# Altium schematic sheet AUDIO2.SchDoc: Audio Codec and Microphone MEMS
size A4; Date: 9/24/2014; Author: P.A.; CompanyName: STMicroelectronics; Organization: Microcontrollers Division; Address1: 12, Rue Jules HOROWITZ; Address2: 38019 Grenoble; Address3: FRANCE; DocumentNumber: 7; Revision: B-07; SheetNumber: 7; SheetTotal: 13; Project: STM32F469I-DISCO
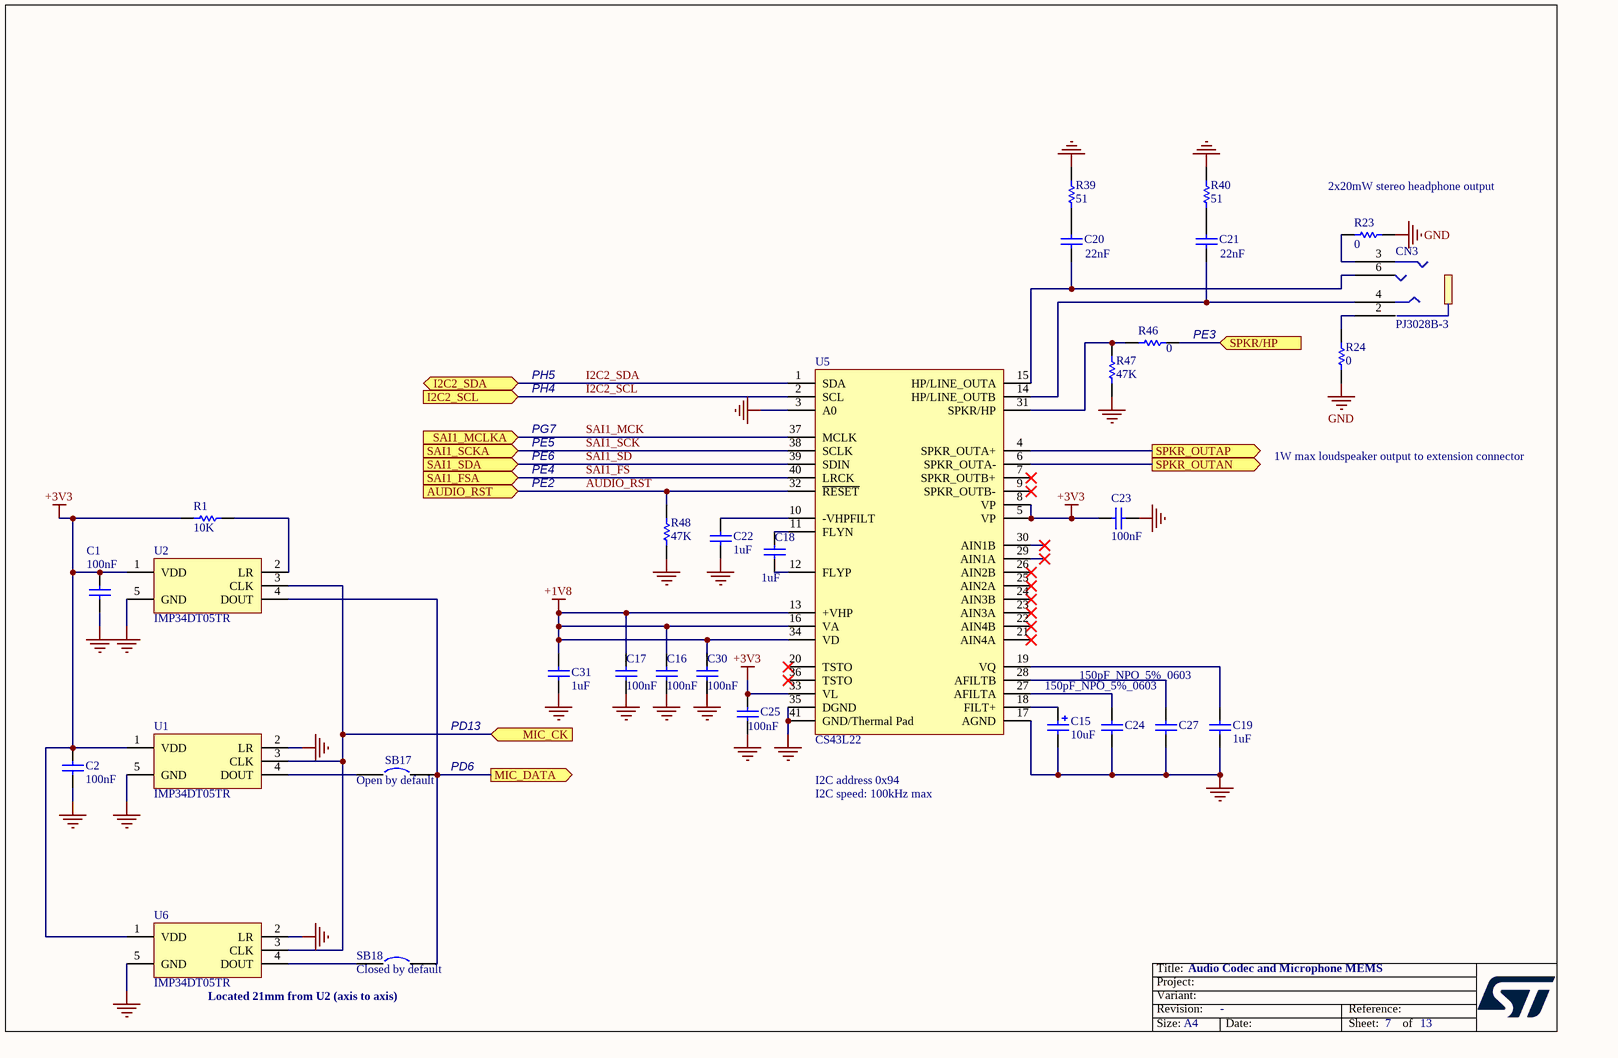
[diagram p0: AUDIO2.SchDoc]

## Parts
C1  100nF  [0402C]
C2  100nF  [0402C]
C15  10uF  [TAN-A]
C16  100nF  [0402C]
C17  100nF  [0402C]
C18  1uF  [0603C]
C19  1uF  [0603C]
C20  22nF  [0603C]
C21  22nF  [0603C]
C22  1uF  [0603C]
C23  100nF  [0402C]
C24  150pF_NPO_5%_0603  [0603C]
C25  100nF  [0402C]
C27  150pF_NPO_5%_0603  [0603C]
C30  100nF  [0402C]
C31  1uF  [0603C]
CN3  PJ3028B-3  [PJ3028B]
R1  10K  [0603R]
R23  0  [0603R]
R24  0  [0603R]
R39  51  [0402R]
R40  51  [0402R]
R46  0  [0603R]
R47  47K  [0603R]
R48  47K  [0603R]
SB17  Open by default  [SB_0603]
SB18  Closed by default  [SB_0603]
U1  IMP34DT05TR  [MP34DT01TR]
U2  IMP34DT05TR  [MP34DT01TR]
U5  CS43L22  [QFN40_0R5_6X6]
U6  IMP34DT05TR  [MP34DT01TR]

## Ports
AUDIO_RST (in), I2C2_SCL (in), I2C2_SDA (bidir), MIC_CK (in), MIC_DATA (out), SAI1_FSA (in), SAI1_MCLKA (in), SAI1_SCKA (in), SAI1_SDA (in), SPKR/HP (in), SPKR_OUTAN (out), SPKR_OUTAP (out)

## Nets
+1V8: C16.1 C17.1 C30.1 C31.1 U5.13(+VHP) U5.16(VA) U5.34(VD)
+3V3: C1.2 C2.2 C23.2 C25.1 R1.2 U1.1(VDD) U2.1(VDD) U5.5(VP) U5.8(VP) U5.33(VL) U6.1(VDD)
GND: C1.1 C2.1 C15.2 C16.2 C17.2 C19.1 C22.1 C23.1 C24.1 C25.2 C27.1 C30.2 C31.2 R23.2 R24.2 R39.2 R40.2 R47.2 R48.1 U1.2(LR) U1.5(GND) U2.5(GND) U5.3(A0) U5.17(AGND) U5.35(DGND) U5.41(GND/Thermal_Pad) U6.2(LR) U6.5(GND)
AUDIO_RST: R48.2 U5.32(~{RESET}) ; port AUDIO_RST
I2C2_SCL: U5.2(SCL) ; port I2C2_SCL
I2C2_SDA: U5.1(SDA) ; port I2C2_SDA
MIC_CK: U1.3(CLK) U2.3(CLK) U6.3(CLK) ; port MIC_CK
MIC_DATA: SB17.2 SB18.2 U2.4(DOUT) ; port MIC_DATA
SAI1_FS: U5.40(LRCK) ; port SAI1_FSA
SAI1_MCK: U5.37(MCLK) ; port SAI1_MCLKA
SAI1_SCK: U5.38(SCLK) ; port SAI1_SCKA
SAI1_SD: U5.39(SDIN) ; port SAI1_SDA
SPKR/HP: R46.2 ; port SPKR/HP
SPKR_OUTAN: U5.6(SPKR_OUTA-) ; port SPKR_OUTAN
SPKR_OUTAP: U5.4(SPKR_OUTA+) ; port SPKR_OUTAP
NetC15_1: C15.1 U5.18(FILT+)
NetC18_1: C18.1 U5.11(FLYN)
NetC18_2: C18.2 U5.12(FLYP)
NetC19_2: C19.2 U5.19(VQ)
NetC20_1: C20.1 CN3.6 U5.15(HP/LINE_OUTA)
NetC20_2: C20.2 R39.1
NetC21_1: C21.1 CN3.4 U5.14(HP/LINE_OUTB)
NetC21_2: C21.2 R40.1
NetC22_2: C22.2 U5.10(-VHPFILT)
NetC24_2: C24.2 U5.27(AFILTA)
NetC27_2: C27.2 U5.28(AFILTB)
NetCN3_2: CN3.2 R24.1
NetCN3_3: CN3.3 R23.1
NetR1_1: R1.1 U2.2(LR)
NetR46_1: R46.1 R47.1 U5.31(SPKR/HP)
NetSB17_1: SB17.1 U1.4(DOUT)
NetSB18_1: SB18.1 U6.4(DOUT)

Not connected (* = marked no-connect by the designer): U5 7(SPKR_OUTB+)* 9(SPKR_OUTB-)* 20(TSTO)* 21(AIN4A)* 22(AIN4B)* 23(AIN3A)* 24(AIN3B)* 25(AIN2A)* 26(AIN2B)* 29(AIN1A)* 30(AIN1B)* 36(TSTO)*

## Notes on the sheet
- (near R23) 2x20mW stereo headphone output
- PH5
- (near R46) PE3
- PE5
- PG7
- PH4
- PE6
- PE4
- PE2
- 1W max loudspeaker output to extension connector
- PD13
- (near SB17) PD6
- I2C address 0x94
- I2C speed: 100kHz max
- Located 21mm from U2 (axis to axis)
- Title:
- Project:
- Size:
- Revision:
- Variant:
- A4
- -
- Date:
- Reference:
- Sheet:
- of

## Library data of the parts
C1 C2 = Cap: Capacitor; Value: 10nF; Ordered by: Subcon; Published: 8-Jun-2000; Revision: July-2002: Re-released for DXP Platform.; Publisher: Altium Limited
C15 = Cap Pol1: Polarized Capacitor (Radial); Ordered by: Subcon; Published: 8-Jun-2000; Revision: July-2002: Re-released for DXP Platform.; Publisher: Altium Limited; Value: 10uF
C16-C19 C22 C23 C25 C30 C31 = CAP: Capacitor; Value: 100pF; Ordered by: Subcon; Published: 8-Jun-2000; Revision: July-2002: Re-released for DXP Platform.; Publisher: Altium Limited
C20 C21 = Cap_22nF_X7R_10%_0603: Capacitor,22nF,50V,X7R,10%,0603,YAGEO; Manuf_Part_1: CC0603KRX7R9BB223; Ordered by: Subcon; Revision: July-2002: Re-released for DXP Platform.; Value: 22nF; Order: CC0603KRX7R9BB223; Manuf_1: YAGEO; ECCN_US/EU: n/a
C24 C27 = Cap_150pF_NPO_5%_0603: Capacitor,150pF,50V,NPO,5%,0603,YAGEO; Order: CC0603JRNPO9BN151; Ordered by: Subcon; Revision: July-2002: Re-released for DXP Platform.; Value: 150pF; Manuf_1: YAGEO; Manuf_Part_1: CC0603JRNPO9BN151; ECCN_US/EU: n/a
CN3 = PJ3028B-3: Manuf_1: QIAOD; Ordered by: Subcon; Silkscreen: AUDIO JACK; Manuf_Part_1: PJ3028B-3
R1 = Res_0_5%_0402: Resistor; Manuf_Part_1: RC0402JR-070RL; Manuf_1: YAGEO; Value: 0; Order: 2363467; Ordered by: Subcon; ECCN_US/EU: n/a; Distrib: FARNELL
R23 R24 R46-R48 = Res1: Resistor; Value: 1K; Ordered by: Subcon; Published: 8-Jun-2000; Revision: July-2002: Re-released for DXP Platform.; Publisher: Altium Limited
R39 R40 = Res_51_1%_0402: Resistor; Manuf_Part_1: RC0402FR-0751RL; Manuf_1: YAGEO; Order: 311-51.0LRTR-ND; Ordered by: Subcon; Value: 51; ECCN_US/EU: n/a; Distrib: DIGIKEY
SB17 = Circuit Breaker: Ordered by: Subcon; Comments: Solder bridge; Fitted: NO; Published: 24-Mar-1999; Revision: July-2002: Re-released for DXP Platform.; Publisher: Altium Limited
SB18 = Circuit Breaker: Ordered by: Subcon; Comments: Solder bridge; Published: 24-Mar-1999; Revision: July-2002: Re-released for DXP Platform.; Publisher: Altium Limited
U1 U2 U6 = MP34DT01TR: MEMS audio sensor; Manuf_1: ST; Manuf_Part_1: IMP34DT05TR
U5 = CS43L22: Low Power, Stereo DAC w/Headphone & Speaker Amps; Manuf_1: Cirrus; Order: CS43L22-CNZ; ECCN_US/EU: EAR99/NEC; Ordered by: Subcon; Manuf_Part_1: CS43L22-CNZ; Distrib: DIGIKEY